# Altium schematic sheet MCU.SchDoc
size Tabloid; DrawnBy: V-P.Rheaume@USherbrooke.ca; Organization: Universite de Sherbrooke; Address1: L3, 12a Rodborough Rd; Address2: Frenchs Forest; Address3: NSW; Address4: Australia 2086; Revision: 0; SheetNumber: 3; SheetTotal: 8; SheetName: Microcontroller
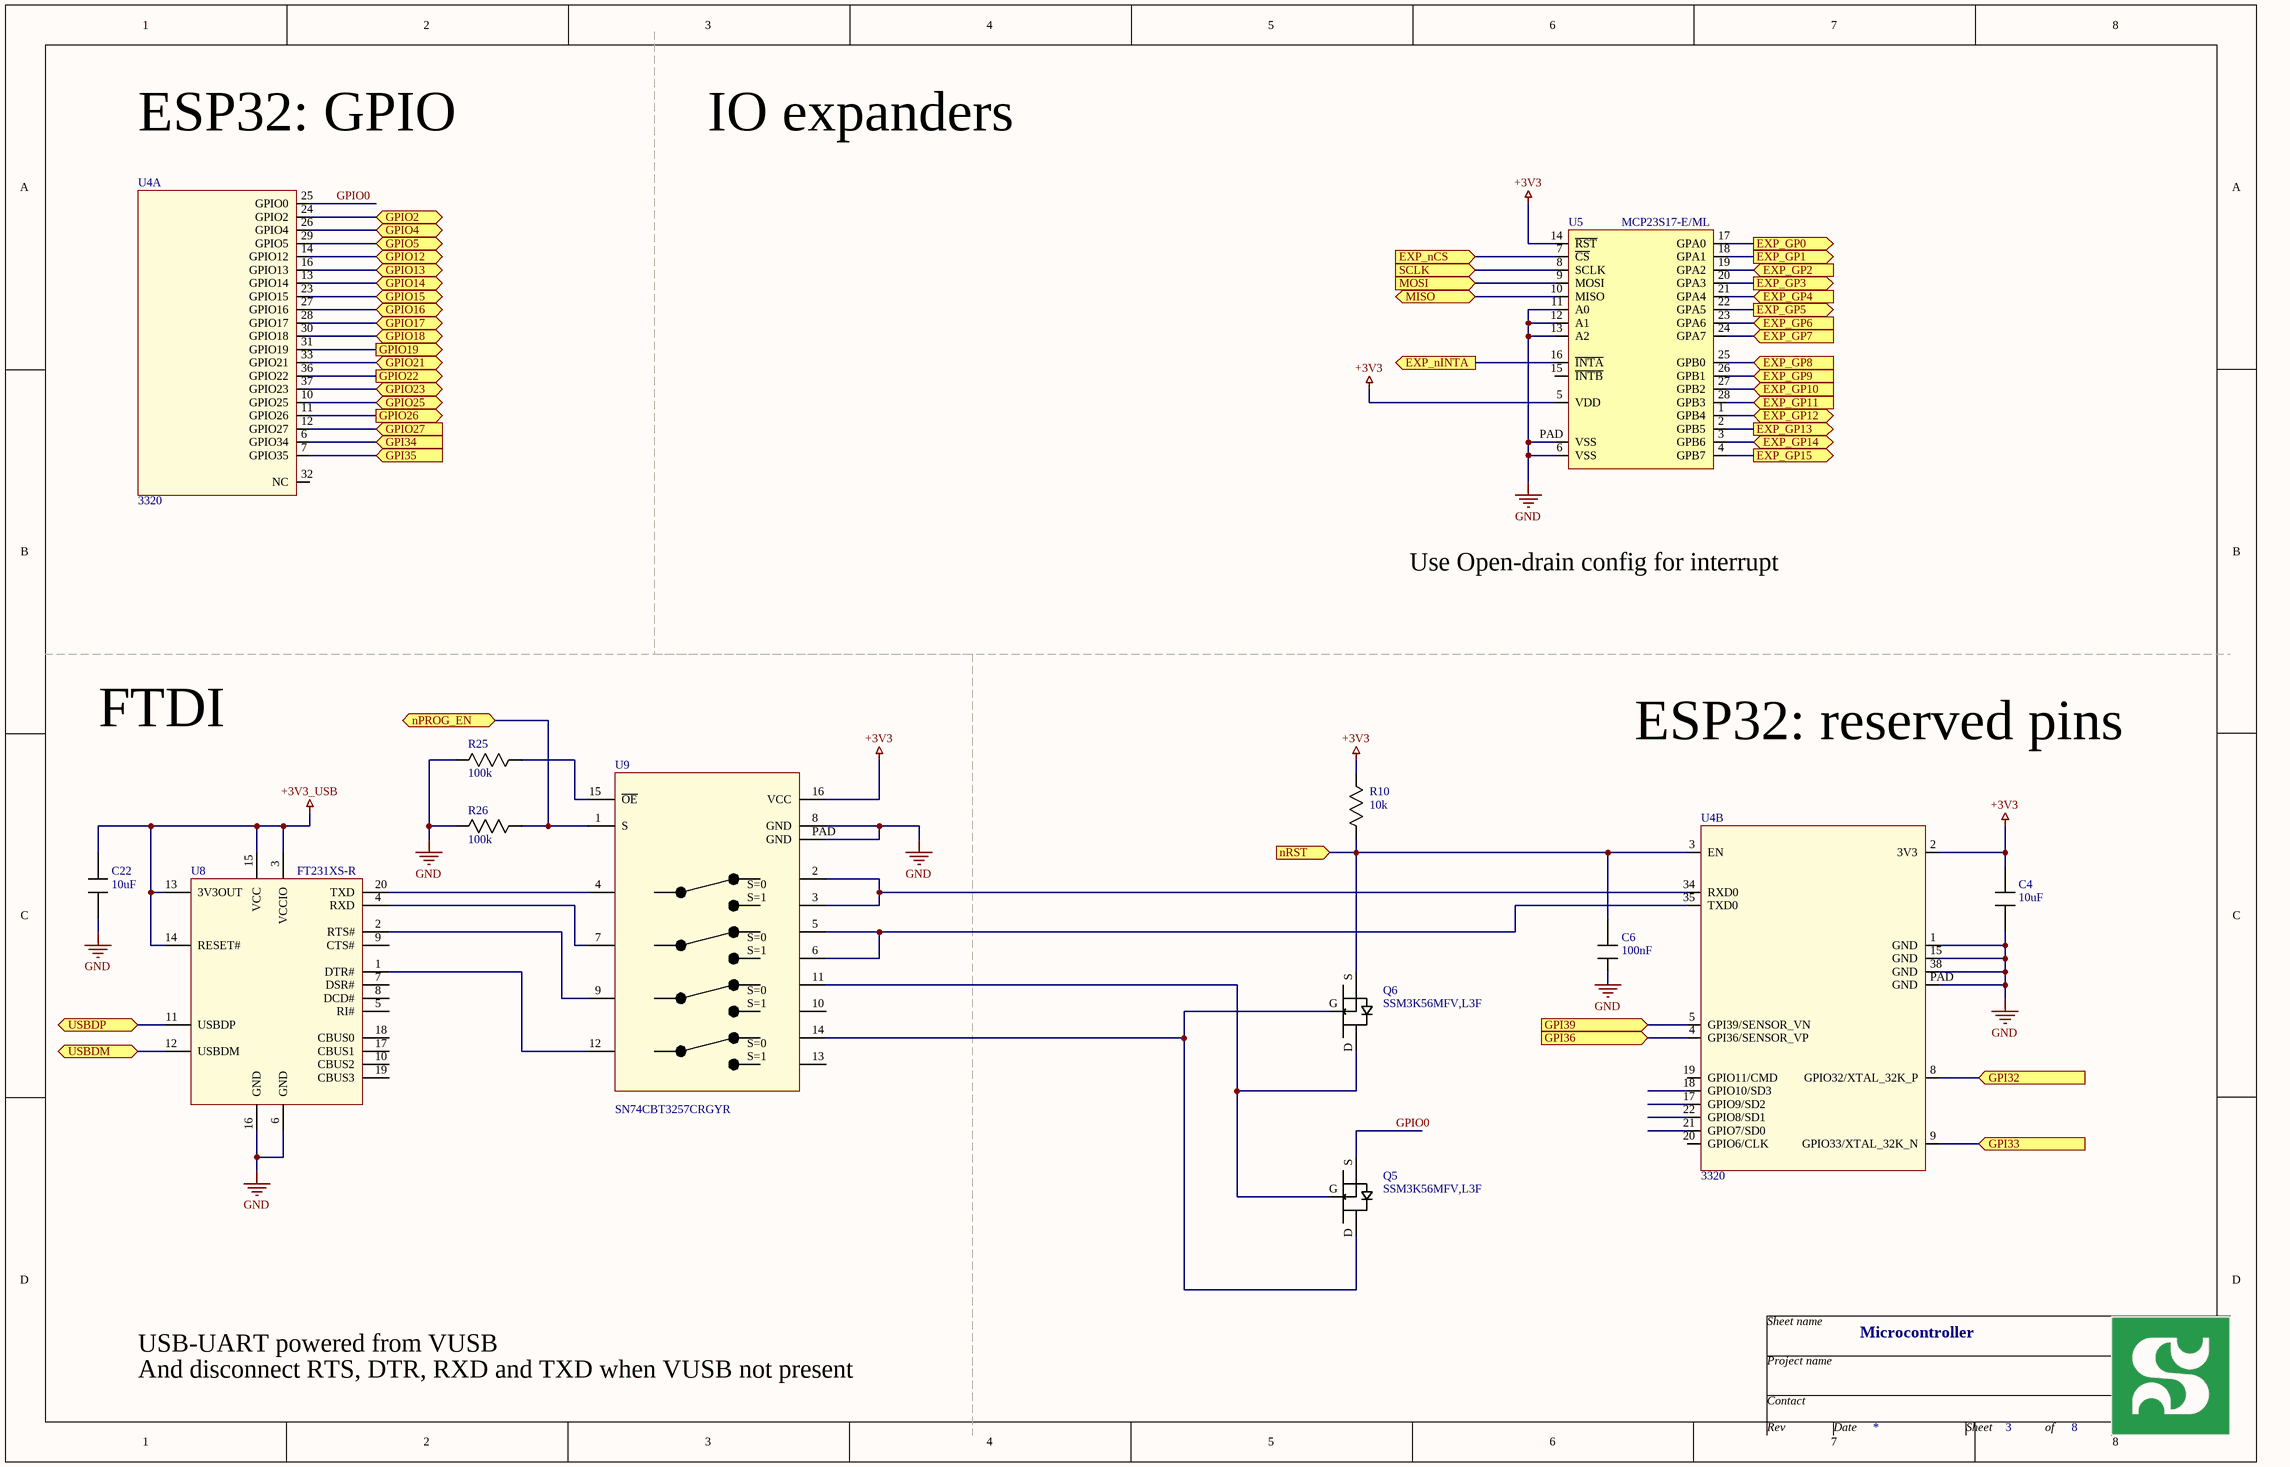
[diagram p0: MCU.SchDoc]

## Parts
C4  value 10uF  [0603]  (hidden comment: Capacitor)
C6  value 100nF  [0603]  (hidden comment: Capacitor)
C22  value 10uF  [0603]  (hidden comment: Capacitor)
Q5  Mfg_PN: SSM3K56MFV,L3F  [SOT723]  (hidden comment: MOSFET_N_GDS)
Q6  Mfg_PN: SSM3K56MFV,L3F  [SOT723]  (hidden comment: MOSFET_N_GDS)
R10  value 10k  [0402]  (hidden comment: Resistor)
R25  value 100k  [0402]  (hidden comment: Resistor)
R26  value 100k  [0402]  (hidden comment: Resistor)
U4  Mfg_PN: 3320  [ESP-WROOM-32]  (hidden comment: ESP-WROOM-32)  (parts A,B of 2)
U5  MCP23S17-E/ML  [QFN28-S]
U8  FT231XS-R  [SSOP20]
U9  SN74CBT3257CRGYR  [QFN16_TI_RGYR]

## Ports
EXP_GP0 (out), EXP_GP1 (out), EXP_GP2 (in), EXP_GP3 (out), EXP_GP4 (in), EXP_GP5 (out), EXP_GP6 (in), EXP_GP7 (in), EXP_GP8 (in), EXP_GP9 (in), EXP_GP10 (in), EXP_GP11 (in), EXP_GP12 (bidir), EXP_GP13 (out), EXP_GP14 (bidir), EXP_GP15 (out), EXP_nCS (in), EXP_nINTA (out), GPI32 (in), GPI33 (in), GPI34 (in), GPI35 (in), GPI36 (in), GPI39 (in), GPIO2 (bidir), GPIO4 (bidir), GPIO5 (bidir), GPIO12 (bidir), GPIO13 (bidir), GPIO14 (bidir), GPIO15 (bidir), GPIO16 (bidir), GPIO17 (bidir), GPIO18 (bidir), GPIO19 (out), GPIO21 (bidir), GPIO22 (out), GPIO23 (bidir), GPIO25 (bidir), GPIO26 (out), GPIO27 (in), MISO (bidir), MOSI (in), nPROG_EN (bidir), nRST (in), SCLK (in), USBDM (bidir), USBDP (bidir)

## Nets
+3V3: C4.2 R10.1 U4.2(3V3) U5.5(VDD) U5.14(~{RST}) U9.16(VCC)
+3V3_USB: C22.2 U8.3(VCCIO) U8.13(3V3OUT) U8.14(RESET#) U8.15(VCC)
GND: C4.1 C6.2 C22.1 R25.2 R26.2 U4.1(GND) U4.15(GND) U4.38(GND) U4.PAD(GND) U5.6(VSS) U5.11(A0) U5.12(A1) U5.13(A2) U5.PAD(VSS) U8.6(GND) U8.16(GND) U9.8(GND) U9.PAD(GND)
EXP_GP0: U5.17(GPA0) ; port EXP_GP0
EXP_GP1: U5.18(GPA1) ; port EXP_GP1
EXP_GP2: U5.19(GPA2) ; port EXP_GP2
EXP_GP3: U5.20(GPA3) ; port EXP_GP3
EXP_GP4: U5.21(GPA4) ; port EXP_GP4
EXP_GP5: U5.22(GPA5) ; port EXP_GP5
EXP_GP6: U5.23(GPA6) ; port EXP_GP6
EXP_GP7: U5.24(GPA7) ; port EXP_GP7
EXP_GP8: U5.25(GPB0) ; port EXP_GP8
EXP_GP9: U5.26(GPB1) ; port EXP_GP9
EXP_GP10: U5.27(GPB2) ; port EXP_GP10
EXP_GP11: U5.28(GPB3) ; port EXP_GP11
EXP_GP12: U5.1(GPB4) ; port EXP_GP12
EXP_GP13: U5.2(GPB5) ; port EXP_GP13
EXP_GP14: U5.3(GPB6) ; port EXP_GP14
EXP_GP15: U5.4(GPB7) ; port EXP_GP15
EXP_nCS: U5.7(~{CS}) ; port EXP_nCS
EXP_nINTA: U5.16(~{INTA}) ; port EXP_nINTA
GPI32: U4.8(GPIO32/XTAL_32K_P) ; port GPI32
GPI33: U4.9(GPIO33/XTAL_32K_N) ; port GPI33
GPI34: U4.6(GPIO34) ; port GPI34
GPI35: U4.7(GPIO35) ; port GPI35
GPI36: U4.4(GPI36/SENSOR_VP) ; port GPI36
GPI39: U4.5(GPI39/SENSOR_VN) ; port GPI39
GPIO0: Q5.S U4.25(GPIO0)
GPIO2: U4.24(GPIO2) ; port GPIO2
GPIO4: U4.26(GPIO4) ; port GPIO4
GPIO5: U4.29(GPIO5) ; port GPIO5
GPIO12: U4.14(GPIO12) ; port GPIO12
GPIO13: U4.16(GPIO13) ; port GPIO13
GPIO14: U4.13(GPIO14) ; port GPIO14
GPIO15: U4.23(GPIO15) ; port GPIO15
GPIO16: U4.27(GPIO16) ; port GPIO16
GPIO17: U4.28(GPIO17) ; port GPIO17
GPIO18: U4.30(GPIO18) ; port GPIO18
GPIO19: U4.31(GPIO19) ; port GPIO19
GPIO21: U4.33(GPIO21) ; port GPIO21
GPIO22: U4.36(GPIO22) ; port GPIO22
GPIO23: U4.37(GPIO23) ; port GPIO23
GPIO25: U4.10(GPIO25) ; port GPIO25
GPIO26: U4.11(GPIO26) ; port GPIO26
GPIO27: U4.12(GPIO27) ; port GPIO27
MISO: U5.10(MISO) ; port MISO
MOSI: U5.9(MOSI) ; port MOSI
nPROG_EN: R26.1 U9.1(S) ; port nPROG_EN
nRST: C6.1 Q6.S R10.2 U4.3(EN) ; port nRST
SCLK: U5.8(SCLK) ; port SCLK
USBDM: U8.12(USBDM) ; port USBDM
USBDP: U8.11(USBDP) ; port USBDP
NetQ5_D: Q5.D Q6.G U9.14(4B1)
NetQ5_G: Q5.G Q6.D U9.11(3B1)
NetR25_1: R25.1 U9.15(~{OE})
NetU4_34: U4.34(RXD0) U9.2(1B1) U9.3(1B2)
NetU4_35: U4.35(TXD0) U9.5(2B1) U9.6(2B2)
NetU8_1: U8.1(DTR#) U9.12(4A)
NetU8_2: U8.2(RTS#) U9.9(3A)
NetU8_4: U8.4(RXD) U9.7(2A)
NetU8_20: U8.20(TXD) U9.4(1A)

Not connected (* = marked no-connect by the designer): U4 17(GPIO9/SD2) 18(GPIO10/SD3) 19(GPIO11/CMD) 20(GPIO6/CLK) 21(GPIO7/SD0) 22(GPIO8/SD1) 32(NC); U5 15(~{INTB}); U8 5(RI#) 7(DSR#) 8(DCD#) 9(CTS#) 10(CBUS2) 17(CBUS1) 18(CBUS0) 19(CBUS3); U9 10(3B2) 13(4B2)

## Notes on the sheet
- ESP32: GPIO
- IO expanders
- Use Open-drain config for interrupt
- FTDI
- ESP32: reserved pins
- USB-UART powered from VUSB
- And disconnect RTS, DTR, RXD and TXD when VUSB not present
- Sheet name
- Project name
- Contact
- Rev
- Date
- Sheet
- of
- (in symbol SN74CBT3257CRGYR) S=0; S=1

## Library data of the parts
C4 C22 = Capacitor: Mfg: Murata; Mfg_PN: GRM188R60J106ME47D; HelpURL: *; NI: *; Supplier1: Digikey; Supplier1_PN: 490-3896-1-ND; Tolerance: *; Type: *; Rating: *
C6 = Capacitor: Mfg: Kemet; Mfg_PN: C0603C104Z4VACTU; HelpURL: *; NI: *; Supplier1: Digikey; Supplier1_PN: 399-1098-1-ND; Tolerance: *; Type: *; Rating: *
Q5 Q6 = MOSFET_N_GDS: NMOS; Mfg: Toshiba; HelpURL: *; NI: *; Rating: *; Supplier1: Digikey; Supplier1_PN: SSM3K56MFVL3FCT-ND; Tolerance: *; Type: *; Value: *
R10 = Resistor: Mfg: Yageo; Mfg_PN: RC0402FR-0710KL; HelpURL: *; NI: *; Supplier1: Digikey; Supplier1_PN: 311-10.0KLRCT-ND; Type: *; Rating: *; Tolerance: *
R25 R26 = Resistor: Mfg: Yageo; Mfg_PN: RC0402JR-07100KL; HelpURL: *; NI: *; Supplier1: Digikey; Supplier1_PN: 311-100KJRCT-ND; Type: *; Rating: *; Tolerance: *
U4 = ESP-WROOM-32: ESP32 MCU module with antenna; Mfg: Adafruit; HelpURL: *; NI: *; Rating: *; Supplier1: Digikey; Supplier1_PN: 1528-1801-ND; Tolerance: *; Type: *; Value: *
U5 = MCP23S17-E/ML: 16-Bit SPI I/O Expander; Mfg: Adafruit; Mfg_PN: 3320; Supplier1: Digikey; Supplier1_PN: 1528-1801-ND
U8 = FT231XS-R: USB to serial converter; Mfg: FTDI; HelpURL: *; Mfg_PN: FT231XS-R; NI: *; Rating: *; Supplier1: Digikey; Supplier1_PN: 768-1129-1-ND; Tolerance: *; Type: *; Value: *
U9 = SN74CBT3257CRGYR: Quad 1-of-2 FET switch; Mfg: Texas Instruments; HelpURL: http://www.ti.com/lit/ds/symlink/sn74cbt3257c.pdf; NI: *; Rating: *; Supplier1: Digikey; Supplier1_PN: 296-19212-1-ND; Tolerance: *; Type: *; Value: *; Mfg_PN: SN74CBT3257CRGYR